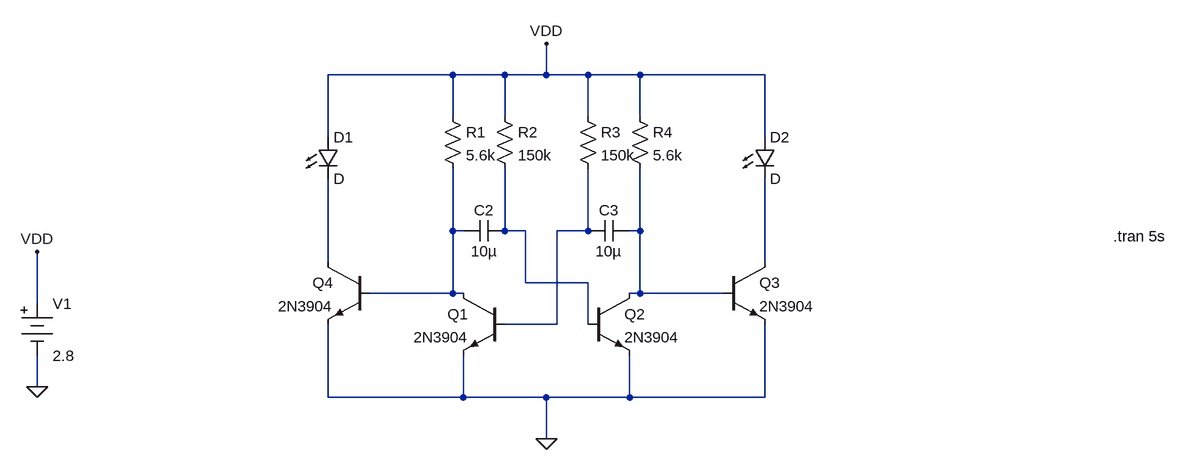
[diagram p0: schematic oscillator.asc]
oscillator.asc, the LTspice schematic file:
Version 4
SHEET 1 920 680
WIRE -224 -208 -416 -208
WIRE -144 -208 -224 -208
WIRE -80 -208 -80 -256
WIRE -80 -208 -144 -208
WIRE -16 -208 -80 -208
WIRE 64 -208 -16 -208
WIRE 256 -208 64 -208
WIRE -224 -144 -224 -208
WIRE -144 -144 -144 -208
WIRE -16 -144 -16 -208
WIRE 64 -144 64 -208
WIRE -416 -112 -416 -208
WIRE 256 -112 256 -208
WIRE -224 32 -224 -64
WIRE -208 32 -224 32
WIRE -144 32 -144 -64
WIRE -144 32 -160 32
WIRE -112 32 -144 32
WIRE -16 32 -16 -64
WIRE -16 32 -64 32
WIRE 0 32 -16 32
WIRE 64 32 64 -64
WIRE 64 32 48 32
WIRE -416 80 -416 -48
WIRE 256 80 256 -48
WIRE -112 112 -112 32
WIRE -16 112 -112 112
WIRE -224 128 -224 32
WIRE -224 128 -352 128
WIRE -208 128 -224 128
WIRE 64 128 64 32
WIRE 64 128 48 128
WIRE 192 128 64 128
WIRE -864 144 -864 64
WIRE -64 176 -64 32
WIRE -64 176 -144 176
WIRE -16 176 -16 112
WIRE -864 272 -864 224
WIRE -416 288 -416 176
WIRE -208 288 -208 224
WIRE -208 288 -416 288
WIRE -80 288 -208 288
WIRE 48 288 48 224
WIRE 48 288 -80 288
WIRE 256 288 256 176
WIRE 256 288 48 288
WIRE -80 352 -80 288
FLAG -864 272 0
FLAG -864 64 VDD
FLAG -80 -256 VDD
FLAG -80 352 0
SYMBOL Misc\\battery -864 128 R0
WINDOW 123 0 0 Left 0
WINDOW 39 0 0 Left 0
SYMATTR InstName V1
SYMATTR Value 2.8
SYMBOL npn -144 128 M0
SYMATTR InstName Q1
SYMATTR Value 2N3904
SYMBOL npn -16 128 R0
SYMATTR InstName Q2
SYMATTR Value 2N3904
SYMBOL cap -144 16 R90
WINDOW 0 0 32 VBottom 2
WINDOW 3 32 32 VTop 2
SYMATTR InstName C2
SYMATTR Value 10µ
SYMBOL cap 48 16 R90
WINDOW 0 0 32 VBottom 2
WINDOW 3 32 32 VTop 2
SYMATTR InstName C3
SYMATTR Value 10µ
SYMBOL res -240 -160 R0
SYMATTR InstName R1
SYMATTR Value 5.6k
SYMBOL res -160 -160 R0
SYMATTR InstName R2
SYMATTR Value 150k
SYMBOL res -32 -160 R0
SYMATTR InstName R3
SYMATTR Value 150k
SYMBOL res 48 -160 R0
SYMATTR InstName R4
SYMATTR Value 5.6k
SYMBOL npn 192 80 R0
SYMATTR InstName Q3
SYMATTR Value 2N3904
SYMBOL npn -352 80 M0
SYMATTR InstName Q4
SYMATTR Value 2N3904
SYMBOL LED -432 -112 R0
SYMATTR InstName D1
SYMBOL LED 240 -112 R0
SYMATTR InstName D2
TEXT 792 40 Left 2 !.tran 5s

The netlist it stands for:
* oscillator.asc
V1 VDD 0 2.8
Q1 N001 N003 0 0 2N3904
Q2 N004 N002 0 0 2N3904
C2 N002 N001 10µ
C3 N004 N003 10µ
R1 VDD N001 5.6k
R2 VDD N002 150k
R3 VDD N003 150k
R4 VDD N004 5.6k
Q3 N006 N004 0 0 2N3904
Q4 N005 N001 0 0 2N3904
D1 VDD N005 D
D2 VDD N006 D
.model D D
.lib standard.dio
.model NPN NPN
.model PNP PNP
.lib standard.bjt
.tran 5s
.backanno
.end